# Altium schematic sheet CONN.SchDoc
size B
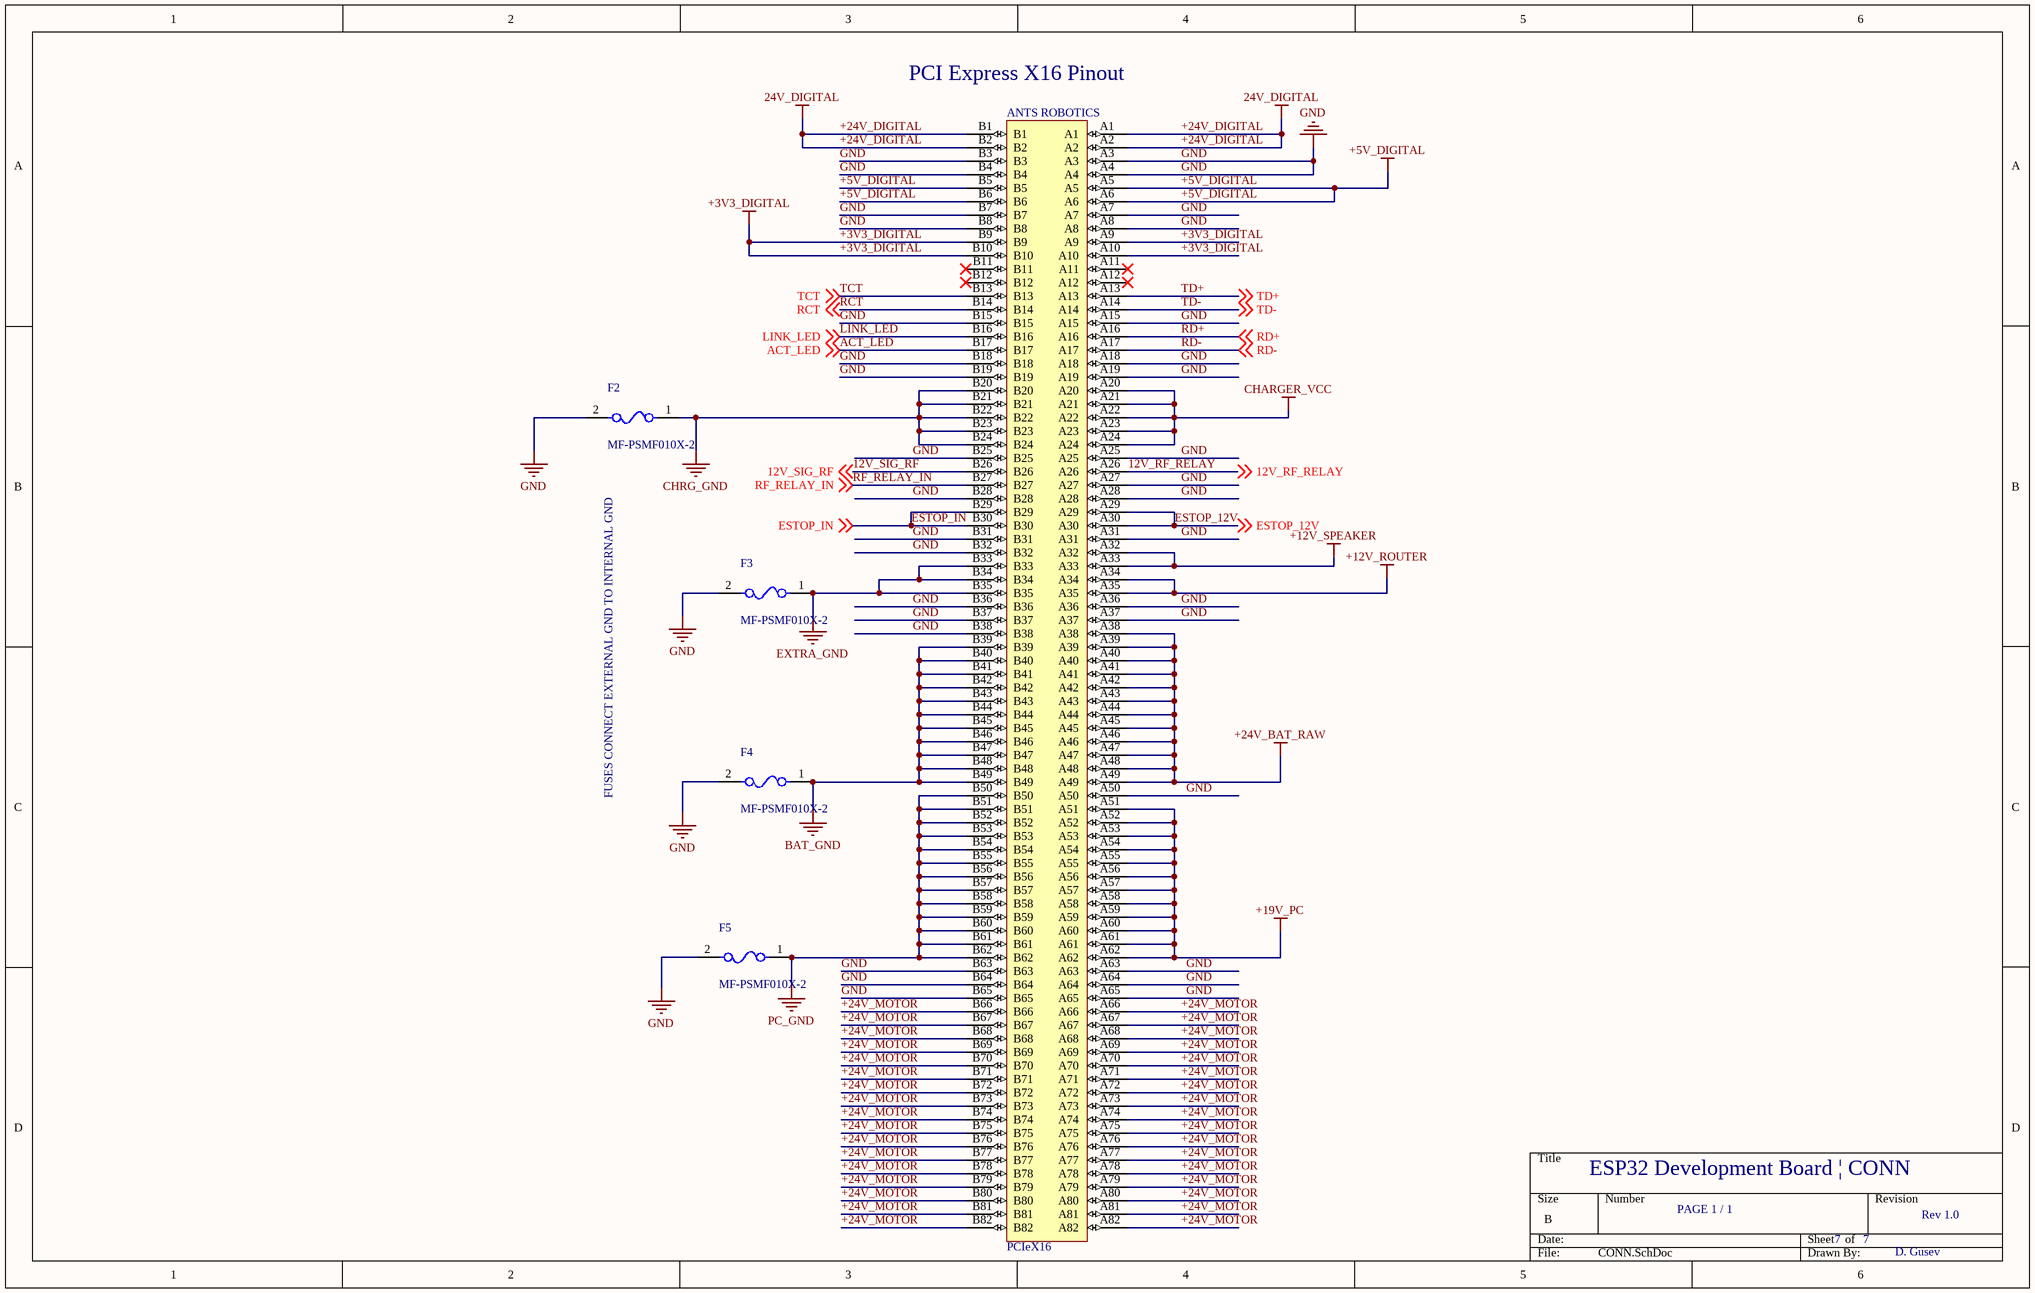
[diagram p0: CONN.SchDoc]

## Parts
ANTS_ROBOTICS  PCIeX16  [PCIeX16]
F2  MF-PSMF010X-2  [FP-MF-PSMF-MFG]
F3  MF-PSMF010X-2  [FP-MF-PSMF-MFG]
F4  MF-PSMF010X-2  [FP-MF-PSMF-MFG]
F5  MF-PSMF010X-2  [FP-MF-PSMF-MFG]

## Nets
+3V3_DIGITAL: ANTS_ROBOTICS.A9 ANTS_ROBOTICS.A10 ANTS_ROBOTICS.B9 ANTS_ROBOTICS.B10
+5V_DIGITAL: ANTS_ROBOTICS.A5 ANTS_ROBOTICS.A6 ANTS_ROBOTICS.B5 ANTS_ROBOTICS.B6
+12V_ROUTER: ANTS_ROBOTICS.A34 ANTS_ROBOTICS.A35
+12V_SPEAKER: ANTS_ROBOTICS.A32 ANTS_ROBOTICS.A33
+19V_PC: ANTS_ROBOTICS.A51 ANTS_ROBOTICS.A52 ANTS_ROBOTICS.A53 ANTS_ROBOTICS.A54 ANTS_ROBOTICS.A55 ANTS_ROBOTICS.A56 ANTS_ROBOTICS.A57 ANTS_ROBOTICS.A58 ANTS_ROBOTICS.A59 ANTS_ROBOTICS.A60 ANTS_ROBOTICS.A61 ANTS_ROBOTICS.A62
+24V_BAT_RAW: ANTS_ROBOTICS.A38 ANTS_ROBOTICS.A39 ANTS_ROBOTICS.A40 ANTS_ROBOTICS.A41 ANTS_ROBOTICS.A42 ANTS_ROBOTICS.A43 ANTS_ROBOTICS.A44 ANTS_ROBOTICS.A45 ANTS_ROBOTICS.A46 ANTS_ROBOTICS.A47 ANTS_ROBOTICS.A48 ANTS_ROBOTICS.A49
+24V_DIGITAL: ANTS_ROBOTICS.A1 ANTS_ROBOTICS.A2 ANTS_ROBOTICS.B1 ANTS_ROBOTICS.B2  [also labelled 24V_DIGITAL]
BAT_GND: ANTS_ROBOTICS.B39 ANTS_ROBOTICS.B40 ANTS_ROBOTICS.B41 ANTS_ROBOTICS.B42 ANTS_ROBOTICS.B43 ANTS_ROBOTICS.B44 ANTS_ROBOTICS.B45 ANTS_ROBOTICS.B46 ANTS_ROBOTICS.B47 ANTS_ROBOTICS.B48 ANTS_ROBOTICS.B49 F4.1
CHARGER_VCC: ANTS_ROBOTICS.A20 ANTS_ROBOTICS.A21 ANTS_ROBOTICS.A22 ANTS_ROBOTICS.A23 ANTS_ROBOTICS.A24
CHRG_GND: ANTS_ROBOTICS.B20 ANTS_ROBOTICS.B21 ANTS_ROBOTICS.B22 ANTS_ROBOTICS.B23 ANTS_ROBOTICS.B24 F2.1
EXTRA_GND: ANTS_ROBOTICS.B33 ANTS_ROBOTICS.B34 ANTS_ROBOTICS.B35 F3.1
GND: ANTS_ROBOTICS.A3 ANTS_ROBOTICS.A4 ANTS_ROBOTICS.A7 ANTS_ROBOTICS.A8 ANTS_ROBOTICS.A15 ANTS_ROBOTICS.A18 ANTS_ROBOTICS.A19 ANTS_ROBOTICS.A25 ANTS_ROBOTICS.A27 ANTS_ROBOTICS.A28 ANTS_ROBOTICS.A31 ANTS_ROBOTICS.A36 ANTS_ROBOTICS.A37 ANTS_ROBOTICS.A50 ANTS_ROBOTICS.A63 ANTS_ROBOTICS.A64 ANTS_ROBOTICS.A65 ANTS_ROBOTICS.B3 ANTS_ROBOTICS.B4 ANTS_ROBOTICS.B7 ANTS_ROBOTICS.B8 ANTS_ROBOTICS.B15 ANTS_ROBOTICS.B18 ANTS_ROBOTICS.B19 ANTS_ROBOTICS.B25 ANTS_ROBOTICS.B28 ANTS_ROBOTICS.B31 ANTS_ROBOTICS.B32 ANTS_ROBOTICS.B36 ANTS_ROBOTICS.B37 ANTS_ROBOTICS.B38 ANTS_ROBOTICS.B63 ANTS_ROBOTICS.B64 ANTS_ROBOTICS.B65 F2.2 F3.2 F4.2 F5.2
PC_GND: ANTS_ROBOTICS.B50 ANTS_ROBOTICS.B51 ANTS_ROBOTICS.B52 ANTS_ROBOTICS.B53 ANTS_ROBOTICS.B54 ANTS_ROBOTICS.B55 ANTS_ROBOTICS.B56 ANTS_ROBOTICS.B57 ANTS_ROBOTICS.B58 ANTS_ROBOTICS.B59 ANTS_ROBOTICS.B60 ANTS_ROBOTICS.B61 ANTS_ROBOTICS.B62 F5.1
12V_RF_RELAY: ANTS_ROBOTICS.A26 ; off-sheet 12V_RF_RELAY
12V_SIG_RF: ANTS_ROBOTICS.B26 ; off-sheet 12V_SIG_RF
+24V_MOTOR: ANTS_ROBOTICS.A66 ANTS_ROBOTICS.A67 ANTS_ROBOTICS.A68 ANTS_ROBOTICS.A69 ANTS_ROBOTICS.A70 ANTS_ROBOTICS.A71 ANTS_ROBOTICS.A72 ANTS_ROBOTICS.A73 ANTS_ROBOTICS.A74 ANTS_ROBOTICS.A75 ANTS_ROBOTICS.A76 ANTS_ROBOTICS.A77 ANTS_ROBOTICS.A78 ANTS_ROBOTICS.A79 ANTS_ROBOTICS.A80 ANTS_ROBOTICS.A81 ANTS_ROBOTICS.A82 ANTS_ROBOTICS.B66 ANTS_ROBOTICS.B67 ANTS_ROBOTICS.B68 ANTS_ROBOTICS.B69 ANTS_ROBOTICS.B70 ANTS_ROBOTICS.B71 ANTS_ROBOTICS.B72 ANTS_ROBOTICS.B73 ANTS_ROBOTICS.B74 ANTS_ROBOTICS.B75 ANTS_ROBOTICS.B76 ANTS_ROBOTICS.B77 ANTS_ROBOTICS.B78 ANTS_ROBOTICS.B79 ANTS_ROBOTICS.B80 ANTS_ROBOTICS.B81 ANTS_ROBOTICS.B82
ACT_LED: ANTS_ROBOTICS.B17 ; off-sheet ACT_LED
ESTOP_12V: ANTS_ROBOTICS.A29 ANTS_ROBOTICS.A30 ; off-sheet ESTOP_12V
ESTOP_IN: ANTS_ROBOTICS.B29 ANTS_ROBOTICS.B30 ; off-sheet ESTOP_IN
LINK_LED: ANTS_ROBOTICS.B16 ; off-sheet LINK_LED
RCT: ANTS_ROBOTICS.B14 ; off-sheet RCT
RD+: ANTS_ROBOTICS.A16 ; off-sheet RD+
RD-: ANTS_ROBOTICS.A17 ; off-sheet RD-
RF_RELAY_IN: ANTS_ROBOTICS.B27 ; off-sheet RF_RELAY_IN
TCT: ANTS_ROBOTICS.B13 ; off-sheet TCT
TD+: ANTS_ROBOTICS.A13 ; off-sheet TD+
TD-: ANTS_ROBOTICS.A14 ; off-sheet TD-

Not connected (* = marked no-connect by the designer): ANTS_ROBOTICS A11* A12* B11* B12*

## Notes on the sheet
- (near ANTS_ROBOTICS) PCI Express X16 Pinout
- FUSES CONNECT EXTERNAL GND TO INTERNAL GND
- ESP32 Development Board | CONN
- PAGE 1 / 1
- 7
- Rev 1.0
- D. Gusev

## Library data of the parts
ANTS_ROBOTICS = PCIeX16: Golden finger, PCIeX16, Dual, Opposite, Pitch 1mm, 164-Position
F2-F5 = CMP-07400-000017-1: PTC RESET FUSE 15V 100MA 0805; Manufacturer: Bourns Inc.; Resistance: 1-7.5Ω; Value: 1-7.5Ω; Current Rating: 40A; Hold Current: 0.1A; Trip Current: 0.3A; Trip Time: 1.5s; Temperature: -40°C to +85°C; ComponentLink2Description: Datasheet; Lead Free: Yes; Ipc Land Pattern Name: CAPC215135X67; Device Class L1: Circuit Protection; Mouser Description: Resettable Fuses - PPTC 0.10A 15V 1ohm; Automotive: No; Octopart: https://octopart.com/mf-psmf010x-2-bourns-7483441; Manufacturer Part Number: MF-PSMF010X-2; RoHS: TRUE; Temperature Range High: +85°C; Digikey Description: PTC RESET FUSE 15V 100MA 0805; Device Class L3: unset; ComponentLink2URL: https://www.bourns.com/docs/Product-Datasheets/mfpsmf.pdf; Height: 0.85mm; Voltage Rating: 15V; Ambient Temperature Range Low: -40°C; Category: Fuse; Package: MF-PSMF; Temperature Range Low: -40°C; Device Class L2: PTC Resettable Fuses; Ambient Temperature Range High: +85°C